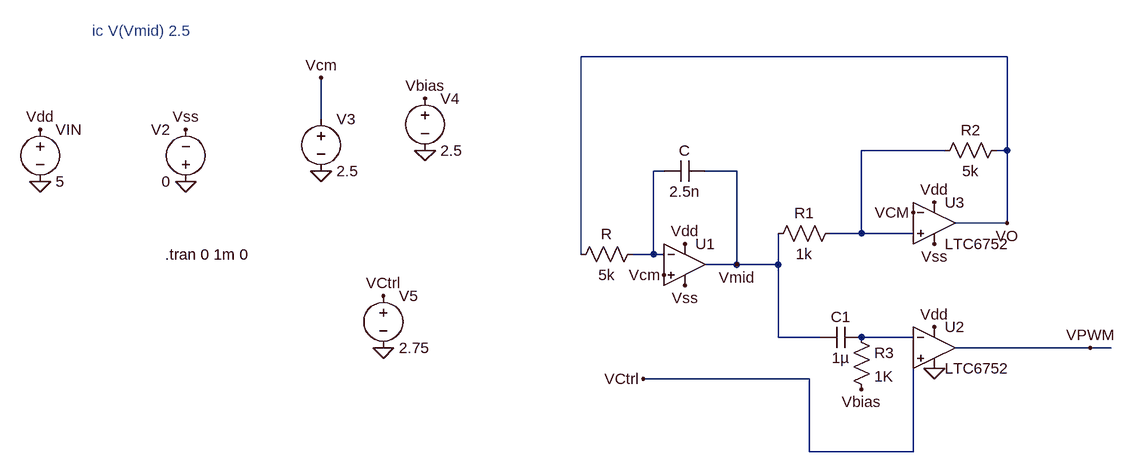
[diagram p0: schematic PWM.asc]
PWM.asc, the LTspice schematic file:
Version 4
SHEET 1 880 680
WIRE 624 -128 -32 -128
WIRE -432 -32 -432 -96
WIRE 528 16 400 16
WIRE 624 16 624 -128
WIRE 624 16 608 16
WIRE 96 48 80 48
WIRE 208 48 160 48
WIRE 624 128 624 16
WIRE 624 128 544 128
WIRE 400 144 400 16
WIRE 400 144 352 144
WIRE 480 144 400 144
WIRE -32 176 -32 -128
WIRE 80 176 80 48
WIRE 80 176 48 176
WIRE 96 176 80 176
WIRE 208 192 208 48
WIRE 208 192 160 192
WIRE 272 192 272 144
WIRE 272 192 208 192
WIRE 272 304 272 192
WIRE 336 304 272 304
WIRE 480 304 400 304
WIRE 752 320 544 320
WIRE 784 320 752 320
WIRE 320 368 64 368
WIRE 320 480 320 368
WIRE 480 480 480 336
WIRE 480 480 320 480
FLAG 128 224 Vss
FLAG 512 160 Vss
FLAG -640 -16 Vss
FLAG 96 208 Vcm
FLAG 480 112 VCM
FLAG -640 64 0
FLAG -864 64 0
FLAG 624 128 VO
FLAG 208 192 Vmid
FLAG 512 96 Vdd
FLAG 128 160 Vdd
FLAG -864 -16 Vdd
FLAG -432 -96 Vcm
FLAG -432 48 0
FLAG 400 384 Vbias
FLAG -272 -64 Vbias
FLAG -272 16 0
FLAG 512 288 Vdd
FLAG 512 352 0
FLAG 64 368 VCtrl
FLAG -336 240 VCtrl
FLAG -336 320 0
FLAG 752 320 VPWM
DATAFLAG 432 304 ""
DATAFLAG 272 192 ""
SYMBOL Opamps\\UniversalOpamp2 128 192 R0
SYMATTR InstName U1
SYMBOL res 64 160 R90
WINDOW 0 0 56 VBottom 2
WINDOW 3 32 56 VTop 2
SYMATTR InstName R
SYMATTR Value 5k
SYMBOL res 368 128 R90
WINDOW 0 0 56 VBottom 2
WINDOW 3 32 56 VTop 2
SYMATTR InstName R1
SYMATTR Value 1k
SYMBOL res 624 0 R90
WINDOW 0 0 56 VBottom 2
WINDOW 3 32 56 VTop 2
SYMATTR InstName R2
SYMATTR Value 5k
SYMBOL cap 160 32 R90
WINDOW 0 0 32 VBottom 2
WINDOW 3 32 32 VTop 2
SYMATTR InstName C
SYMATTR Value 2.5n
SYMBOL voltage -864 -32 R0
WINDOW 123 0 0 Left 0
WINDOW 39 0 0 Left 0
SYMATTR InstName VIN
SYMATTR Value 5
SYMBOL voltage -640 80 R180
WINDOW 0 24 96 Left 2
WINDOW 3 24 16 Left 2
WINDOW 123 0 0 Left 0
WINDOW 39 0 0 Left 0
SYMATTR InstName V2
SYMATTR Value 0
SYMBOL voltage -432 -48 R0
WINDOW 123 0 0 Left 0
WINDOW 39 0 0 Left 0
SYMATTR InstName V3
SYMATTR Value 2.5
SYMBOL Comparators\\LTC6752 512 64 R0
SYMATTR InstName U3
SYMBOL cap 400 288 R90
WINDOW 0 0 32 VBottom 2
WINDOW 3 32 32 VTop 2
SYMATTR InstName C1
SYMATTR Value 1µ
SYMBOL res 384 288 R0
SYMATTR InstName R3
SYMATTR Value 1K
SYMBOL voltage -272 -80 R0
WINDOW 123 0 0 Left 0
WINDOW 39 0 0 Left 0
SYMATTR InstName V4
SYMATTR Value 2.5
SYMBOL Comparators\\LTC6752 512 256 R0
SYMATTR InstName U2
SYMBOL voltage -336 224 R0
WINDOW 123 0 0 Left 0
WINDOW 39 0 0 Left 0
SYMATTR InstName V5
SYMATTR Value 2.75
TEXT -672 176 Left 2 !.tran 0 1m 0
TEXT -784 -168 Left 2 ;ic V(Vmid) 2.5

The netlist it stands for:
* PWM.asc
XU1 Vcm N002 Vdd Vss Vmid level.2 Avol=1Meg GBW=10Meg Slew=10Meg ilimit=25m rail=0 Vos=0 phimargin=45 en=0 enk=0 in=0 ink=0 Rin=500Meg  ; pins IN+ IN- V+ V- OUT
R N002 VO 5k
R1 N001 Vmid 1k
R2 VO N001 5k
C Vmid N002 2.5n
VIN Vdd 0 5
V2 0 Vss 0
V3 Vcm 0 2.5
XU3 N001 Vcm Vdd Vss VO LTC6752  ; pins In+ In- V+ V- OUT
C1 N003 Vmid 1µ
R3 N003 Vbias 1K
V4 Vbias 0 2.5
XU2 VCtrl N003 Vdd 0 VPWM LTC6752  ; pins In+ In- V+ V- OUT
V5 VCtrl 0 2.75
.tran 0 1m 0
* ic V(Vmid) 2.5
.lib UniversalOpamps2.sub
.lib LTC7.lib
.backanno
.end